# Altium schematic sheet Communication.SchDoc
size A3; SheetNumber: 3; SheetTotal: 4
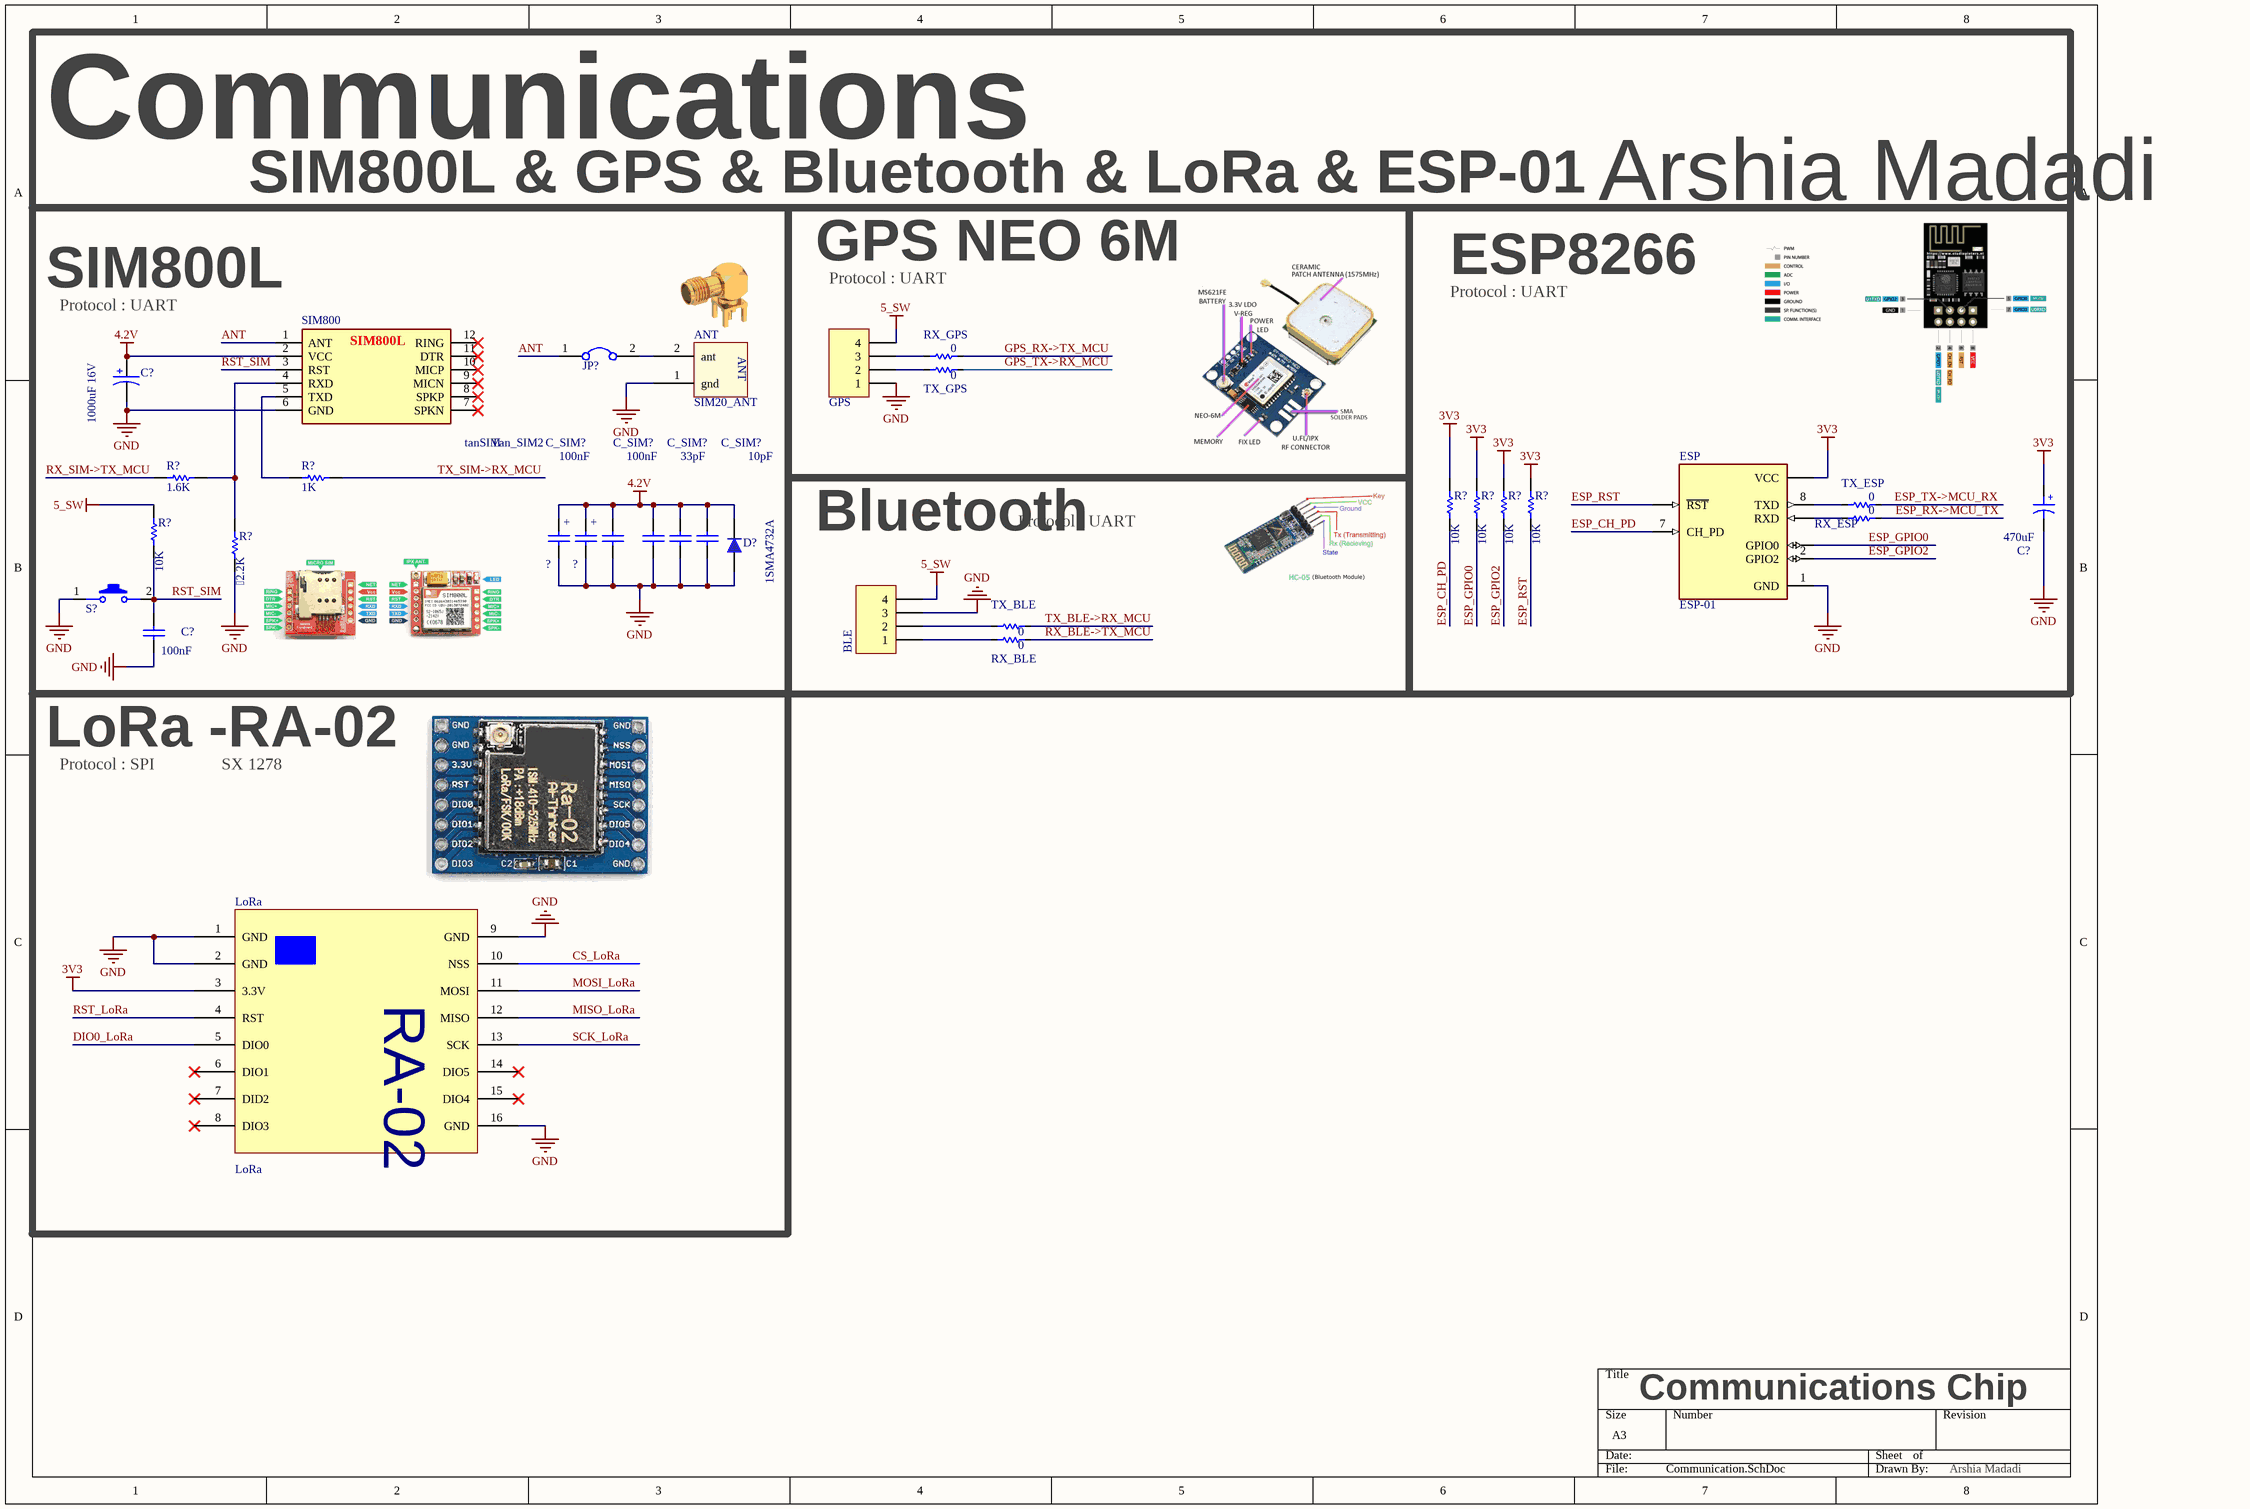
[diagram p0: Communication.SchDoc]

## Parts
(Parts that share a designator on the sheet are numbered #1, #2 ... from top to bottom, then left to right.)
?#1  tanSIM  [MY_CAP_SMD-C]
?#2  Tan_SIM2  [MY_CAP_SMD-C]
ANT  SIM20_ANT  [MY_SIM20_ANT]
BLE  Header 4  [My_1X04]  (value not drawn)
C?#1  1000uF 16V  [SMD_1000uf 16V]
C?#2  470uF  [CAP SMD 470uF]
C?#3  100nF  [MY_CAP_SMD_0603]
C_SIM?#1  100nF  [CAP1206]
C_SIM?#2  100nF  [CAP1206]
C_SIM?#3  33pF  [CAP1206]
C_SIM?#4  10pF  [CAP1206]
D?  1SMA4732A  [SMA DIODE 2]
ESP  ESP-01  [MODULE_ESP-01]
GPS  Header 4  [My_1X04]  (value not drawn)
JP?  Jumper  [Jumper Small - 2.54 - GRAY]  (value not drawn)
LoRa  LoRa  [PCBComponent_1]
R?#1  1.6K  [RESC3413X04N]
R?#2  1K  [RESC3413X04N]
R?#3  10K  [RESC3413X04N]
R?#4  10K  [RESC3413X04N]
R?#5  10K  [RESC3413X04N]
R?#6  10K  [RESC3413X04N]
R?#7  10K  [RESC3413X04N]
R?#8  2.2K  [RESC3413X04N]
RX_BLE  0  [0603]
RX_ESP  0  [0603]
RX_GPS  0  [0603]
S?  SW_PB2  [SMD_ALPS_SKQMBBE010]  (value not drawn)
SIM800  (no value)  [SIM800L]
TX_BLE  0  [0603]
TX_ESP  0  [0603]
TX_GPS  0  [0603]

## Blocks framed on the sheet
SIM800L & GPS & Bluetooth & LoRa & ESP-01: ?#1 ?#2 ANT C?#1 C?#3 C_SIM?#1-C_SIM?#4 D? JP? R?#1 R?#2 R?#7 R?#8 S? SIM800
GPS NEO 6M: GPS RX_GPS TX_GPS
Arshia Madadi: C?#2 ESP R?#3-R?#6 RX_ESP TX_ESP
Bluetooth: BLE RX_BLE TX_BLE
LoRa -RA-02: LoRa

## Nets
3V3: C?#2.1 ESP.5(VCC) LoRa.3(3.3V) R?#3.2 R?#4.2 R?#5.2 R?#6.2
4.2V: ?#1.+ ?#2.+ C?#1.1 C_SIM?#1.1 C_SIM?#2.1 C_SIM?#3.1 C_SIM?#4.1 D?.2 SIM800.2(VCC)
5_SW: BLE.4 GPS.4 R?#7.2
GND: ?#1.- ?#2.- ANT.1(gnd) BLE.3 C?#1.2 C?#2.2 C?#3.2 C_SIM?#1.2 C_SIM?#2.2 C_SIM?#3.2 C_SIM?#4.2 D?.1 ESP.1(GND) GPS.1 LoRa.1(GND) LoRa.2(GND) LoRa.9(GND) LoRa.16(GND) R?#8.1 S?.1(Button) SIM800.6(GND)
ANT: JP?.1 SIM800.1(ANT)
CS_LoRa: LoRa.10(NSS)
DIO0_LoRa: LoRa.5(DIO0)
ESP_CH_PD: ESP.7(CH_PD) R?#3.1
ESP_GPIO0: ESP.3(GPIO0) R?#4.1
ESP_GPIO2: ESP.2(GPIO2) R?#5.1
ESP_RST: ESP.6(~{RST}) R?#6.1
ESP_RX->MCU_TX: RX_ESP.2
ESP_TX->MCU_RX: TX_ESP.2
GPS_RX->TX_MCU: RX_GPS.2
GPS_TX->RX_MCU: TX_GPS.2
MISO_LoRa: LoRa.12(MISO)
MOSI_LoRa: LoRa.11(MOSI)
RST_LoRa: LoRa.4(RST)
RST_SIM: C?#3.1 R?#7.1 S?.2 SIM800.3(RST)
RX_BLE->TX_MCU: RX_BLE.2
RX_SIM->TX_MCU: R?#1.1
SCK_LoRa: LoRa.13(SCK)
TX_BLE->RX_MCU: TX_BLE.2
TX_SIM->RX_MCU: R?#2.2
NetANT_2: ANT.2(ant) JP?.2
NetBLE_1: BLE.1 RX_BLE.1
NetBLE_2: BLE.2 TX_BLE.1
NetESP_4: ESP.4(RXD) RX_ESP.1
NetESP_8: ESP.8(TXD) TX_ESP.1
NetGPS_2: GPS.2 TX_GPS.1
NetGPS_3: GPS.3 RX_GPS.1
NetR?#1_2: R?#1.2 R?#8.2 SIM800.4(RXD)
NetR?#2_1: R?#2.1 SIM800.5(TXD)

Not connected (* = marked no-connect by the designer): LoRa 6(DIO1)* 7(DID2)* 8(DIO3)* 14(DIO5)* 15(DIO4)*; SIM800 7(SPKN)* 8(SPKP)* 9(MICN)* 10(MICP)* 11(DTR)* 12(RING)*

## Notes on the sheet
- Communications
- SIM800L
- Protocol : UART
- ESP8266
- Protocol : SPI
- SX 1278
- Communications Chip
- Arshia Madadi
- (in symbol Cap ELECTROLITIC TOTAL SIZE) +
- (in symbol Capacitor) +
- (in symbol LoRa) RA-02

## Library data of the parts
?#1 ?#2 = CAP_TANTAL_C: Value: 3300u
ANT = SIM20_ANT: ANT
BLE GPS = Header 4: Header, 4-Pin; LatestRevisionDate: 17-Jul-2002; LatestRevisionNote: Re-released for DXP Platform.; Publisher: Altium Limited
C?#1 = Capacitor: Electrolyte Capacitor
C?#2 = Cap ELECTROLITIC TOTAL SIZE: Capacitor Electrical SMD; Designer: Abbas Basereh; VALUE: 1uF; Data: 16-12-2016; Part. No: *
C?#3 = CAP SMD_0603: 1.6 mm × 0.8 mm
C_SIM?#1 C_SIM?#2 = CAP SMD PACKAGE: TOTAL CAPACITOR SMD PACK; Designer: Abbas Basereh; Desc.: CAP SMD TOTAL PACKAGES; Data: 2017-3-10; VALUE: 100nF
C_SIM?#3 C_SIM?#4 = CAP SMD PACKAGE: TOTAL CAPACITOR SMD PACK; Designer: Abbas Basereh; Desc.: CAP SMD TOTAL PACKAGES; VALUE: 100nF; Data: 2017-3-10
D? = Diode SMD Package: Diode SMD Pakage
ESP = ESP-01: ESP-01M ESP8266 DIP Adapter series Transceiver; 802.11 b/g/n (Wi-Fi, WiFi, WLAN) Evaluation Board; MF: AI-Thinker; SnapEDA_Link: https://www.snapeda.com/parts/ESP-01/AI-Thinker/view-part/?ref=snap; Package: Non-Standard AI-Thinker; Value: *; MP: ESP-01; Check_prices: https://www.snapeda.com/parts/ESP-01/AI-Thinker/view-part/?ref=eda
JP? = Jumper: Company: E.P.I.L; Defualt State: Close; Design Date: 2011/11/02
R?#1-R?#8 = RES 0805 0.125W: RES 0805; Designer: Abbas Basereh; Desc.: RES SMD 0805; Data: 16-12-2016
RX_BLE RX_ESP RX_GPS TX_BLE TX_ESP TX_GPS = Res: Resistor; Published: 8-Jun-2000; LatestRevisionDate: 17-Jul-2002; LatestRevisionNote: Re-released for DXP Platform.; PackageReference: AXIAL-0.3; Publisher: Altium Limited
S? = SW_PB2: 2 Pin Push Button Switch; Company: SJ Libraries; Designer: Eng. Saeid Jorablo; Mounting Technology: Surface Mount\Through-Hole; ComponentLink1Description: Datasheet; Pin Count: 0; Update Date: 6/3/2012; Category: MISC; HelpURL: http://s3.picofile.com/file/7443264187/Coming_Soon_logo.gif
SIM800 = SIM800L: Publisher: 3DFootprint.ir